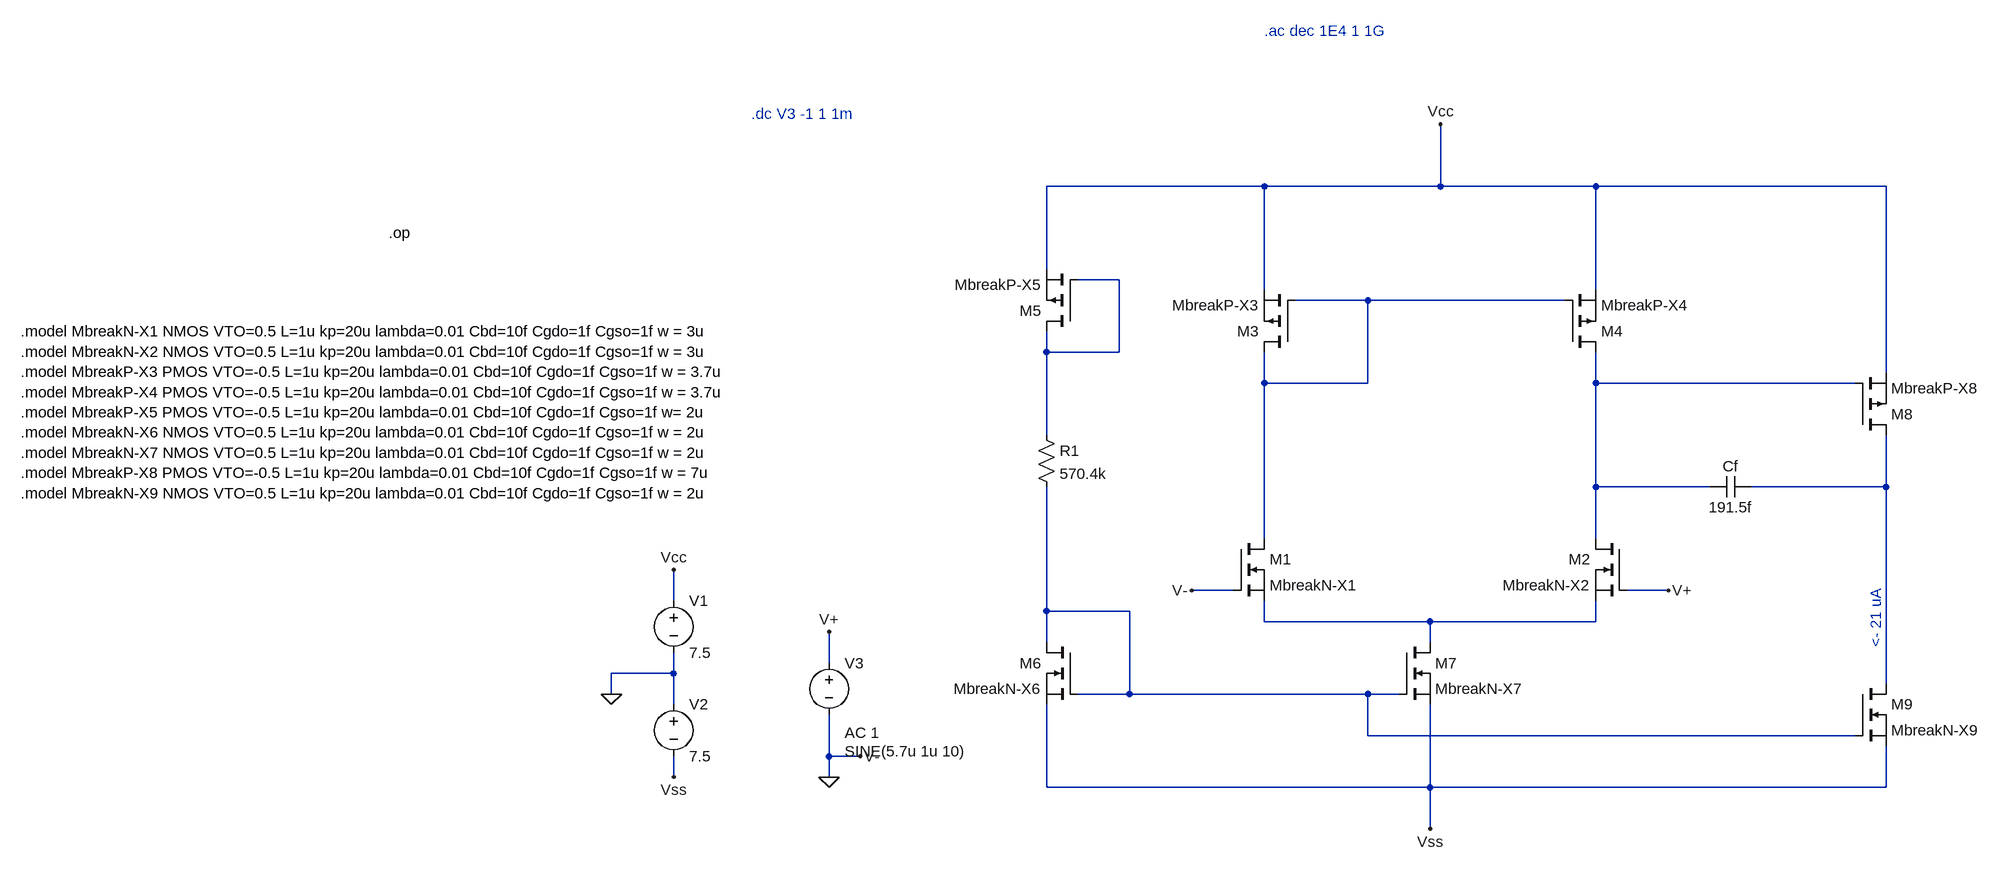
[diagram p0: schematic val_int_v2.asc]
val_int_v2.asc, the LTspice schematic file:
Version 4.1
SHEET 1 3020 808
WIRE 1216 -640 880 -640
WIRE 1488 -640 1488 -736
WIRE 1488 -640 1216 -640
WIRE 1728 -640 1488 -640
WIRE 2176 -640 1728 -640
WIRE 880 -512 880 -640
WIRE 992 -496 928 -496
WIRE 1216 -480 1216 -640
WIRE 1728 -480 1728 -640
WIRE 1376 -464 1264 -464
WIRE 1680 -464 1376 -464
WIRE 880 -384 880 -416
WIRE 992 -384 992 -496
WIRE 992 -384 880 -384
WIRE 2176 -352 2176 -640
WIRE 1216 -336 1216 -384
WIRE 1376 -336 1376 -464
WIRE 1376 -336 1216 -336
WIRE 1728 -336 1728 -384
WIRE 2128 -336 1728 -336
WIRE 880 -256 880 -384
WIRE 1728 -176 1728 -336
WIRE 1904 -176 1728 -176
WIRE 2176 -176 2176 -256
WIRE 2176 -176 1968 -176
WIRE 1216 -96 1216 -336
WIRE 1728 -96 1728 -176
WIRE 1168 -16 1104 -16
WIRE 1840 -16 1776 -16
WIRE 304 0 304 -48
WIRE 880 16 880 -176
WIRE 1008 16 880 16
WIRE 1216 32 1216 0
WIRE 1472 32 1216 32
WIRE 1728 32 1728 0
WIRE 1728 32 1472 32
WIRE 880 64 880 16
WIRE 1472 64 1472 32
WIRE 544 96 544 48
WIRE 304 112 304 80
WIRE 304 112 208 112
WIRE 2176 128 2176 -176
WIRE 208 144 208 112
WIRE 1008 144 1008 16
WIRE 1008 144 928 144
WIRE 1376 144 1008 144
WIRE 1424 144 1376 144
WIRE 304 160 304 112
WIRE 1376 208 1376 144
WIRE 2128 208 1376 208
WIRE 544 240 544 176
WIRE 592 240 544 240
WIRE 304 272 304 240
WIRE 544 272 544 240
WIRE 880 288 880 160
WIRE 1472 288 1472 160
WIRE 1472 288 880 288
WIRE 2176 288 2176 224
WIRE 2176 288 1472 288
WIRE 1472 352 1472 288
FLAG 304 -48 Vcc
FLAG 304 272 Vss
FLAG 208 144 0
FLAG 544 272 0
FLAG 592 240 V-
FLAG 544 48 V+
FLAG 1840 -16 V+
FLAG 1104 -16 V-
FLAG 1488 -736 Vcc
FLAG 1472 352 Vss
DATAFLAG 2176 -176 ""
SYMBOL voltage 304 -16 R0
WINDOW 123 0 0 Left 0
WINDOW 39 0 0 Left 0
SYMATTR InstName V1
SYMATTR Value 7.5
SYMBOL voltage 304 144 R0
WINDOW 123 0 0 Left 0
WINDOW 39 0 0 Left 0
SYMATTR InstName V2
SYMATTR Value 7.5
SYMBOL voltage 544 80 R0
WINDOW 3 24 152 Left 2
WINDOW 123 24 124 Left 2
WINDOW 39 0 0 Left 0
SYMATTR Value SINE(5.7u 1u 10)
SYMATTR Value2 AC 1
SYMATTR InstName V3
SYMBOL pmos 928 -416 R180
SYMATTR InstName M5
SYMATTR Value MbreakP-X5
SYMBOL res 864 -272 R0
SYMATTR InstName R1
SYMATTR Value 570.4k
SYMBOL nmos 928 64 M0
SYMATTR InstName M6
SYMATTR Value MbreakN-X6
SYMBOL nmos 1424 64 R0
SYMATTR InstName M7
SYMATTR Value MbreakN-X7
SYMBOL nmos 1168 -96 R0
SYMATTR InstName M1
SYMATTR Value MbreakN-X1
SYMBOL nmos 1776 -96 M0
SYMATTR InstName M2
SYMATTR Value MbreakN-X2
SYMBOL pmos 2128 -256 M180
SYMATTR InstName M8
SYMATTR Value MbreakP-X8
SYMBOL nmos 2128 128 R0
SYMATTR InstName M9
SYMATTR Value MbreakN-X9
SYMBOL pmos 1264 -384 R180
SYMATTR InstName M3
SYMATTR Value MbreakP-X3
SYMBOL pmos 1680 -384 M180
SYMATTR InstName M4
SYMATTR Value MbreakP-X4
SYMBOL cap 1968 -192 R90
WINDOW 0 0 32 VBottom 2
WINDOW 3 32 32 VTop 2
SYMATTR InstName Cf
SYMATTR Value 191.5f
TEXT -704 -416 Left 2 !.model MbreakN-X1 NMOS VTO=0.5 L=1u kp=20u lambda=0.01 Cbd=10f Cgdo=1f Cgso=1f w = 3u\n.model MbreakN-X2 NMOS VTO=0.5 L=1u kp=20u lambda=0.01 Cbd=10f Cgdo=1f Cgso=1f w = 3u\n.model MbreakP-X3 PMOS VTO=-0.5 L=1u kp=20u lambda=0.01 Cbd=10f Cgdo=1f Cgso=1f w = 3.7u\n.model MbreakP-X4 PMOS VTO=-0.5 L=1u kp=20u lambda=0.01 Cbd=10f Cgdo=1f Cgso=1f w = 3.7u\n.model MbreakP-X5 PMOS VTO=-0.5 L=1u kp=20u lambda=0.01 Cbd=10f Cgdo=1f Cgso=1f w= 2u\n.model MbreakN-X6 NMOS VTO=0.5 L=1u kp=20u lambda=0.01 Cbd=10f Cgdo=1f Cgso=1f w = 2u\n.model MbreakN-X7 NMOS VTO=0.5 L=1u kp=20u lambda=0.01 Cbd=10f Cgdo=1f Cgso=1f w = 2u\n.model MbreakP-X8 PMOS VTO=-0.5 L=1u kp=20u lambda=0.01 Cbd=10f Cgdo=1f Cgso=1f w = 7u\n.model MbreakN-X9 NMOS VTO=0.5 L=1u kp=20u lambda=0.01 Cbd=10f Cgdo=1f Cgso=1f w = 2u
TEXT 2160 72 VLeft 2 ;<- 21 uA
TEXT -136 -568 Left 2 !.op
TEXT 424 -752 Left 2 ;.dc V3 -1 1 1m
TEXT 1216 -880 Left 2 ;.ac dec 1E4 1 1G

The netlist it stands for:
* val_int_v2.asc
V1 Vcc 0 7.5
V2 0 Vss 7.5
V3 V+ 0 SINE(5.7u 1u 10) AC 1
M5 N001 N001 Vcc Vcc MbreakP-X5
R1 N001 N005 570.4k
M6 N005 N005 Vss Vss MbreakN-X6
M7 N006 N005 Vss Vss MbreakN-X7
M1 N002 0 N006 N006 MbreakN-X1
M2 N003 V+ N006 N006 MbreakN-X2
M8 N004 N003 Vcc Vcc MbreakP-X8
M9 N004 N005 Vss Vss MbreakN-X9
M3 N002 N002 Vcc Vcc MbreakP-X3
M4 N003 N002 Vcc Vcc MbreakP-X4
Cf N004 N003 191.5f
.model NMOS NMOS
.model PMOS PMOS
.lib standard.mos
.model MbreakN-X1 NMOS VTO=0.5 L=1u kp=20u lambda=0.01 Cbd=10f Cgdo=1f Cgso=1f w = 3u
.model MbreakN-X2 NMOS VTO=0.5 L=1u kp=20u lambda=0.01 Cbd=10f Cgdo=1f Cgso=1f w = 3u
.model MbreakP-X3 PMOS VTO=-0.5 L=1u kp=20u lambda=0.01 Cbd=10f Cgdo=1f Cgso=1f w = 3.7u
.model MbreakP-X4 PMOS VTO=-0.5 L=1u kp=20u lambda=0.01 Cbd=10f Cgdo=1f Cgso=1f w = 3.7u
.model MbreakP-X5 PMOS VTO=-0.5 L=1u kp=20u lambda=0.01 Cbd=10f Cgdo=1f Cgso=1f w= 2u
.model MbreakN-X6 NMOS VTO=0.5 L=1u kp=20u lambda=0.01 Cbd=10f Cgdo=1f Cgso=1f w = 2u
.model MbreakN-X7 NMOS VTO=0.5 L=1u kp=20u lambda=0.01 Cbd=10f Cgdo=1f Cgso=1f w = 2u
.model MbreakP-X8 PMOS VTO=-0.5 L=1u kp=20u lambda=0.01 Cbd=10f Cgdo=1f Cgso=1f w = 7u
.model MbreakN-X9 NMOS VTO=0.5 L=1u kp=20u lambda=0.01 Cbd=10f Cgdo=1f Cgso=1f w = 2u
* <- 21 uA
.op
* .dc V3 -1 1 1m
* .ac dec 1E4 1 1G
.backanno
.end